# EAGLE design BlinkyBoard_wide (EAGLE 7.1.0)
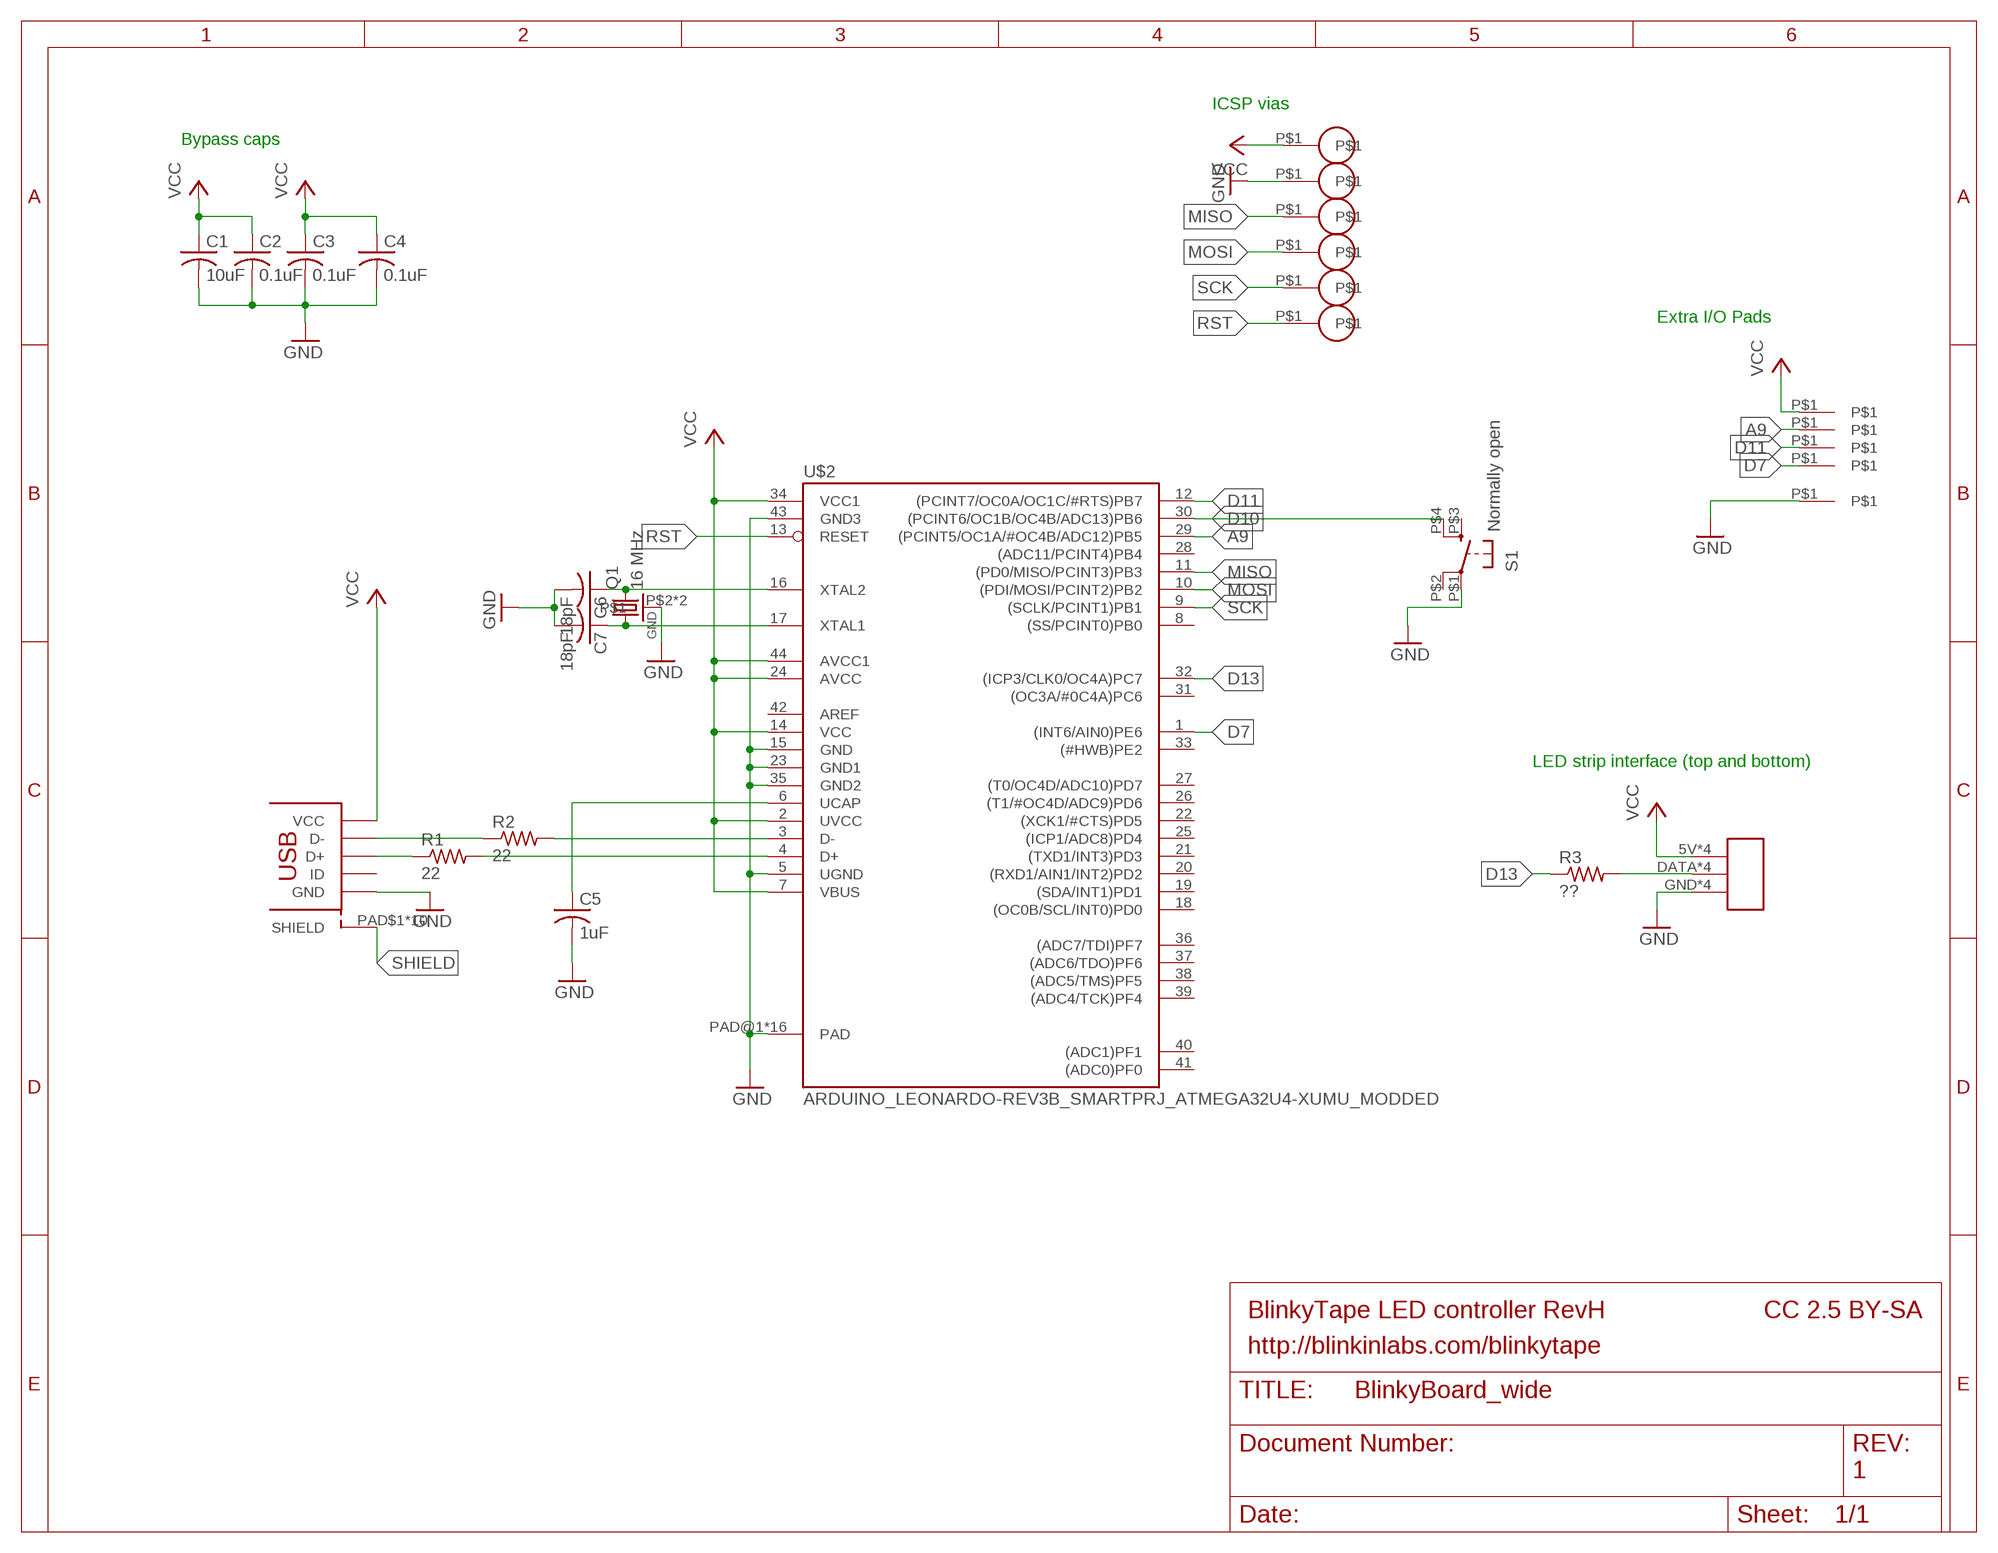
[diagram p0: schematic, sheet 1]

## Parts
C1  10uF  C-USC0603K  [C0603K]
C2  0.1uF  C_US  [CAP_0402_KEMET_MEDIAN]
C3  0.1uF  C_US  [CAP_0402_KEMET_MEDIAN]
C4  0.1uF  C_US  [CAP_0402_KEMET_MEDIAN]
C5  1uF  C_US  [CAP_0402_KEMET_MEDIAN]
C6  18pF  C_US  [CAP_0402_KEMET_MEDIAN]
C7  18pF  C_US  [CAP_0402_KEMET_MEDIAN]
Q1  16 MHz  CRYSTAL_4PAD2520  [CRSYTAL_2520]
R1  22  R_US  [RES_0402_KEMET_MEDIAN]
R2  22  R_US  [RES_0402_KEMET_MEDIAN]
R3  ??  R_US  [RES_0402_KEMET_MEDIAN]
S1  Normally open  GLOWBOARD_KMR211G  [GLOWBOARD_KMR211G_SWITCH]
U$1  TEST_VIA  [TEST_VIA_.5MM]
U$2  ARDUINO_LEONARDO-REV3B_SMARTPRJ_ATMEGA32U4-XUMU_MODDED  [QFN44ML_7X7_LONGLEADS_MOD]
U$3  TEST_VIA  [TEST_VIA_.5MM]
U$4  MICRO_USBSMT+THRUHULE  [MICRO_USB_FCI_THRUHOLE]
U$5  TEST_VIA  [TEST_VIA_.5MM]
U$6  TEST_VIA  [TEST_VIA_.5MM]
U$7  TEST_VIA  [TEST_VIA_.5MM]
U$8  TEST_VIA  [TEST_VIA_.5MM]
U$9  WS2812B_CONNECTORWIDE  [WS2812B_WIDE_CONNECTOR]
U$10  TEST_PAD_SMT  [TEST_PAD_SMT]
U$11  TEST_PAD_SMT  [TEST_PAD_SMT]
U$12  TEST_PAD_SMT  [TEST_PAD_SMT]
U$13  TEST_PAD_SMT  [TEST_PAD_SMT]
U$14  TEST_PAD_SMT  [TEST_PAD_SMT]

## Nets
A9: U$2.29((PCINT5/OC1A/#OC4B/ADC12)PB5) U$11.P$1
D7: U$2.1((INT6/AIN0)PE6) U$10.P$1
D10: S1.P$4(S1) U$2.30((PCINT6/OC1B/OC4B/ADC13)PB6)
D11: U$2.12((PCINT7/OC0A/OC1C/#RTS)PB7) U$14.P$1
D13: R3.P$1 U$2.32((ICP3/CLK0/OC4A)PC7)
D+: R1.P$2 U$2.4(D+)
D+_IN: R1.P$1 U$4.PIN$3(D+)
D-: R2.P$2 U$2.3(D-)
D-_IN: R2.P$1 U$4.PIN$2(D-)
GND: C1.2 C2.P$2 C3.P$2 C4.P$2 C5.P$2 C6.P$2 C7.P$2 Q1.P$2 Q1.P$4 S1.P$1(P) U$2.5(UGND) U$2.15(GND) U$2.23(GND1) U$2.35(GND2) U$2.43(GND3) U$2.PAD@1(PAD) U$2.PAD@2(PAD) U$2.PAD@3(PAD) U$2.PAD@4(PAD) U$2.PAD@5(PAD) U$2.PAD@6(PAD) U$2.PAD@7(PAD) U$2.PAD@8(PAD) U$2.PAD@9(PAD) U$2.PAD@10(PAD) U$2.PAD@11(PAD) U$2.PAD@12(PAD) U$2.PAD@13(PAD) U$2.PAD@14(PAD) U$2.PAD@15(PAD) U$2.PAD@16(PAD) U$4.PIN$5(GND) U$7.P$1 U$9.GND U$9.GND1(GND) U$9.GND_1(GND) U$9.GND_2(GND) U$13.P$1
LED_DATA: R3.P$2 U$9.DATA U$9.DATA1(DATA) U$9.DATA_1(DATA) U$9.DATA_2(DATA)
MISO: U$1.P$1 U$2.11((PD0/MISO/PCINT3)PB3)
MOSI: U$2.10((PDI/MOSI/PCINT2)PB2) U$3.P$1
N$2: C5.P$1 U$2.6(UCAP)
N$8: C6.P$1 Q1.P$3 U$2.16(XTAL2)
N$9: C7.P$1 Q1.P$1 U$2.17(XTAL1)
RST: U$2.13(RESET) U$6.P$1
SCK: U$2.9((SCLK/PCINT1)PB1) U$5.P$1
SHIELD: U$4.PAD$1(SHIELD) U$4.PAD$2(SHIELD) U$4.PAD$3(SHIELD) U$4.PAD$4(SHIELD) U$4.PAD$5(SHIELD) U$4.PAD$6(SHIELD) U$4.PAD$7(SHIELD) U$4.PAD$8(SHIELD) U$4.PAD$9(SHIELD) U$4.PAD$10(SHIELD)
VCC: C1.1 C2.P$1 C3.P$1 C4.P$1 U$2.2(UVCC) U$2.7(VBUS) U$2.14(VCC) U$2.24(AVCC) U$2.34(VCC1) U$2.44(AVCC1) U$4.PIN$1(VCC) U$8.P$1 U$9.5V U$9.5V1(5V) U$9.5V_1(5V) U$9.5V_2(5V) U$12.P$1
Unconnected: S1.P$2(P1) S1.P$3(S) U$2.8((SS/PCINT0)PB0) U$2.18((OC0B/SCL/INT0)PD0) U$2.19((SDA/INT1)PD1) U$2.20((RXD1/AIN1/INT2)PD2) U$2.21((TXD1/INT3)PD3) U$2.22((XCK1/#CTS)PD5) U$2.25((ICP1/ADC8)PD4) U$2.26((T1/#OC4D/ADC9)PD6) U$2.27((T0/OC4D/ADC10)PD7) U$2.28((ADC11/PCINT4)PB4) U$2.31((OC3A/#0C4A)PC6) U$2.33((#HWB)PE2) U$2.36((ADC7/TDI)PF7) U$2.37((ADC6/TDO)PF6) U$2.38((ADC5/TMS)PF5) U$2.39((ADC4/TCK)PF4) U$2.40((ADC1)PF1) U$2.41((ADC0)PF0) U$4.PIN$4(ID)

## Notes on the sheet
- ICSP vias
- Bypass caps
- Extra I/O Pads
- LED strip interface (top and bottom)
- BlinkyTape LED controller RevH | CC 2.5 BY-SA
- http://blinkinlabs.com/blinkytape
- 1

## Power pins joined to a net without a drawn wire
AREF: U$2.42(AREF)

## Library data of the parts
C1 = adafruit:C-US: CAPACITOR, American symbol
C2-C7 = blinkiverse:C_US
Q1 = blinkiverse:CRYSTAL_4PAD
R1-R3 = blinkiverse:R_US
S1 = blinkiverse:GLOWBOARD_KMR211G: KMR211G SWITCH
U$1 U$3 U$5-U$8 = blinkiverse:TEST_VIA
U$2 = blinkiverse:ARDUINO_LEONARDO-REV3B_SMARTPRJ_ATMEGA32U4-XU
U$4 = blinkiverse:MICRO_USB
U$9 = blinkinlabs:WS2812B_CONNECTOR
U$10-U$14 = blinkiverse:TEST_PAD_SMT

## Board
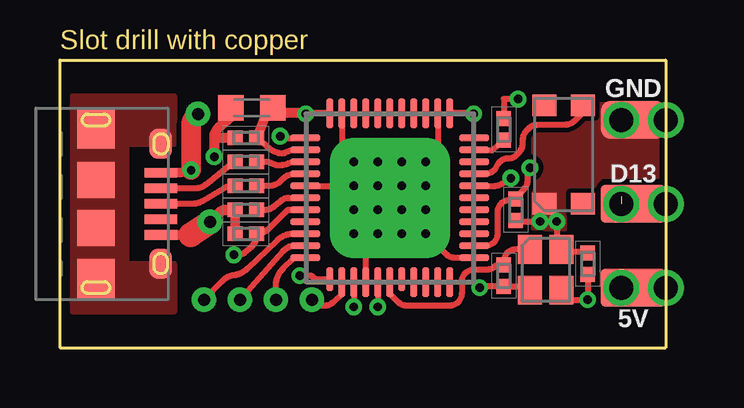
[diagram p1: board, top side]
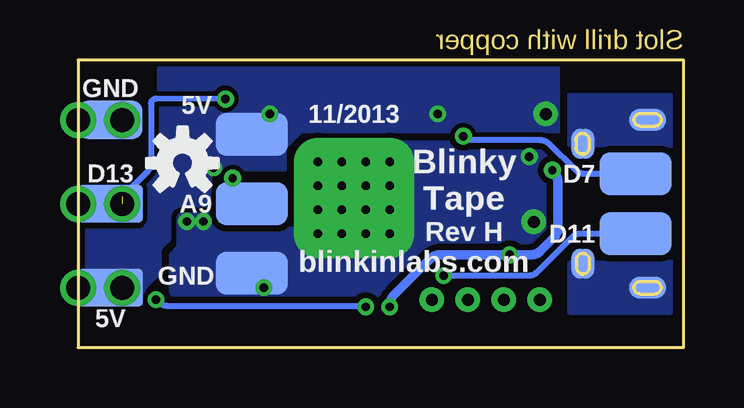
[diagram p2: board, bottom side, seen from below]

Size 25.25 x 12 mm. Coordinates in mm from the lower left corner, seen from the top.
Outline: 0,0 0,12 25.25,12 25.25,0 0,0
Copper layers (1*16): Top 0.0356mm / dielectric 1.5011mm / Bottom 0.0356mm
Design rules "BlinkyTape *": minimum track width 0.25mm, minimum drill 0.35mm, track to track 0.2mm, track to pad 0.2mm, pad to pad 0.2mm, via to via 0.2mm, smd to smd 0.2mm, copper to edge 8mil, drill to drill 0.25mm, minimum pad ring 7mil, minimum via ring 7mil, stop-mask expansion 2mil, vias tented up to drill 0.35mm, thermal gap 10mil

### Footprints (pad centres in the part's own frame; a part is rotated, then mirrored left to right if it is on the bottom)
C0603K = smd 1.05 x 1.08: 1 -0.875,0; 2 0.875,0
CAP_0402_KEMET_MEDIAN = smd 0.62 x 0.62: P$1 -0.45,0; P$2 0.45,0
CRSYTAL_2520 = smd 1.2 x 1: P$1 -0.85,-0.65; P$2 0.85,-0.65; P$3 0.85,0.65; P$4 -0.85,0.65
RES_0402_KEMET_MEDIAN = smd 0.62 x 0.62: P$1 -0.45,0; P$2 0.45,0
GLOWBOARD_KMR211G_SWITCH = smd 0.9 x 1: P$1 -2,0.8; P$2 2.1,0.8; P$3 -2,-0.8; P$4 2.1,-0.8
TEST_VIA_.5MM = drill 0.5 pad 1.016: P$1 0,0
QFN44ML_7X7_LONGLEADS_MOD = smd 1.25 x 0.275: 1 -3.525,2.5; 2 -3.525,2; 3 -3.525,1.5; 4 -3.525,1; 5 -3.525,0.5; 6 -3.525,0; 7 -3.525,-0.5; 8 -3.525,-1; 9 -3.525,-1.5; 10 -3.525,-2; 11 -3.525,-2.5; 23 3.525,-2.5; 24 3.525,-2; 25 3.525,-1.5; 26 3.525,-1; 27 3.525,-0.5; 28 3.525,0; 29 3.525,0.5; 30 3.525,1; 31 3.525,1.5; 32 3.525,2; 33 3.525,2.5 | smd 0.275 x 1: 12 -2.5,-3.4; 18 0.5,-3.4 | smd 0.275 x 1.25: 13 -2,-3.525; 14 -1.5,-3.525; 15 -1,-3.525; 16 -0.5,-3.525; 17 0,-3.525; 19 1,-3.525; 20 1.5,-3.525; 21 2,-3.525; 22 2.5,-3.525; 34 2.5,3.525; 35 2,3.525; 36 1.5,3.525; 37 1,3.525; 38 0.5,3.525; 39 0,3.525; 40 -0.5,3.525; 41 -1,3.525; 42 -1.5,3.525; 43 -2,3.525; 44 -2.5,3.525 | drill 0.35 pad 2: PAD@1 -1.5,1.5; PAD@4 1.5,1.5; PAD@13 -1.5,-1.5; PAD@16 1.5,-1.5 | drill 0.35 pad 2 square: PAD@2 -0.5,1.5; PAD@3 0.5,1.5; PAD@5 -1.5,0.5; PAD@8 1.5,0.5; PAD@9 -1.5,-0.5; PAD@12 1.5,-0.5; PAD@14 -0.5,-1.5; PAD@15 0.5,-1.5 | drill 0.35 pad 1 square: PAD@6 -0.5,0.5; PAD@7 0.5,0.5; PAD@10 -0.5,-0.5; PAD@11 0.5,-0.5
MICRO_USB_FCI_THRUHOLE = smd 1.645 x 1.55: PAD$1 -3.123,0; PAD$4 3.123,0 | smd 1.5 x 1.55: PAD$2 -1,0; PAD$3 1,0 | smd 1.25 x 0.95: PAD$5 -2.5,2.7; PAD$6 2.5,2.7 | smd 0.9 x 1.55 bottom: PAD$7 -3.5,0; PAD$8 3.5,0 | smd 1.25 x 0.95 bottom: PAD$9 -2.5,2.7; PAD$10 2.5,2.7 | smd 0.4 x 1.35: PIN$1 -1.3,2.7; PIN$2 -0.65,2.7; PIN$3 0,2.7; PIN$4 0.65,2.7; PIN$5 1.3,2.7
WS2812B_WIDE_CONNECTOR = smd 2.7 x 1.6 bottom: 5V 0,3.5; DATA1 0,0; GND1 0,-3.5 | smd 2.7 x 1.6: 5V1 0,3.5; DATA 0,0; GND 0,-3.5 | drill 1: 5V_1 1.35,3.5; 5V_2 -0.5,3.5 | drill 1 pad 1.5: DATA_1 1.35,0; DATA_2 -0.5,0; GND_1 1.35,-3.5; GND_2 -0.5,-3.5
TEST_PAD_SMT = smd 1.8 x 3: P$1 0,0

### Placement (x,y rotation side)
C1  8,10 180 top
C2  7.75,8.75 180 top
C3  7.75,4.75 180 top
C4  19,5.75 270 top
C5  7.75,5.75 180 top
C6  22,3.5 90 top
C7  18.5,3 270 top
Q1  20.25,3.25 270 top
R1  7.75,6.75 0 top
R2  7.75,7.75 0 top
R3  18.5,9.1 90 top
S1  21,8 90 top
U$1  9,2 0 top
U$2  13.75,6.25 0 top
U$3  7.5,2 0 top
U$4  1.5,6 270 top
U$5  6,2 0 top
U$6  10.5,2 0 top
U$7  6.25,5.25 0 top
U$8  5.75,9.75 0 top
U$9  23.9,6 180 bottom
U$10  2,7.25 90 bottom
U$11  18,6 90 bottom
U$12  18,8.9 270 bottom
U$13  18,3.1 270 bottom
U$14  2,4.75 270 bottom
U$15  [OSHW-LOGO-S]  20.89,7.7 0 bottom

### Tracks (layer width: path | path; a pad name or v marks a point on that pad's centre or on a via)
A9  (via drill 0.35)
  Top 0.254: U$2.29 18.15,6.75 arc33 18.43,6.83 v18.8,7.07
  Bottom 0.254: U$11.P$1 18.55,6.5 v18.8,7.07
D7  (via drill 0.35)
  Top 0.254: v9.18,8.82 9.14,8.75 U$2.1
  Bottom 0.254: U$10.P$1 4.13,7.25 arc47 4.5,7.41 5.6,8.49 arc-47 5.97,8.65 9.12,8.65 v9.18,8.82
D10
  Top 0.254: U$2.30 17.7,7.25 arc45 18.13,7.43 18.26,7.66 arc-45 18.65,7.9 arc45 18.98,7.98 19.12,8.12 arc45 19.3,8.55 19.3,8.65 arc-45 19.48,9.08 19.52,9.12 arc-45 19.95,9.3 21.05,9.3 arc45 21.48,9.48 21.8,9.8 S1.P$4
D11  (via drill 0.35)
  Top 0.254: U$2.12 10.73,2.85 arc-45 10.59,2.91 10.56,2.94 arc45 10.42,3 v10,3
  Bottom 0.254: U$14.P$1 4.29,4.75 arc-45 4.65,4.6 6.1,3.15 arc45 6.46,3 v10,3
D13
  Top 0.254: U$2.32 18.05,8.25 R3.P$1
D+
  Top 0.254: U$2.4 9.81,7.25 arc45 9.21,6.96 arc-45 8.81,6.75 R1.P$2
D+_IN
  Top 0.254: R1.P$1 7.19,6.75 arc31 6.83,6.65 5.92,6.1 arc-31 5.56,6 U$4.PIN$3
D-
  Top 0.254: U$2.3 9.7,7.75 9.42,7.64 arc-23 9.02,7.6 8.78,7.71 arc24 8.57,7.75 R2.P$2
D-_IN
  Top 0.254: U$4.PIN$2 5.65,6.65 arc39 6.09,6.81 7.21,7.72 arc-39 R2.P$1
GND  (via drill 0.35)  (1 unrouted)
  Top 0.254: U$2.5 U$2.PAD@5 | U$2.15 12.75,4.04 arc-45 12.9,4.4 U$2.PAD@14 | U$2.PAD@16 16.1,3.9 arc45 16.46,3.75 U$2.23 17.25,3.73 | U$2.43 11.75,8.46 arc45 11.9,8.1 U$2.PAD@1 | U$2.35 15.75,8.46 arc-45 15.6,8.1 U$2.PAD@4 | 19,5.12 18.95,5.3 C4.P$2 19.04,5.26 v20.02,5.26 | v17.5,2.5 17.55,2.55 C7.P$2 19.45,2.55 Q1.P$2 | C6.P$2 22,4 21,4 Q1.P$4 | Q1.P$4 20.82,4.18 | v20.71,5.26 20.71,4.29 Q1.P$4
  Top 0.4: C2.P$2 7,8.75 | 7.25,5.75 C5.P$2 C3.P$2 | U$4.PIN$5 5.45,4.7
  Top 0.406: C1.2 7.12,9.62 6.6,9.15 arc48 6.43,8.78 6.43,8.75 | 6.43,8.75 v6.43,7.96 | 7,8.75 6.43,8.75 | U$7.P$1 6.6,5.6 arc-45 6.96,5.75 C5.P$2
  Top 1.016: 5.45,4.7 U$7.P$1
  pour Bottom (isolate 0.254): 5.75,8.6 15.6,8.6 16,8.2 16,5 19.6,5 19.6,5.6 20.85,5.6 arc-90 21.1,5.35 21.1,4.3 arc45 21.17,4.13 21.33,3.97 arc-45 21.4,3.8 21.4,0 5.75,0
  pour Top: 25.1,7.1 25.1,10.2 21.1,10.2 21.1,9.4 19.7,9.4 19.7,4.9 21.1,4.9 21.1,6.6 22.2,6.6 22.6,7.1
LED_DATA  (via drill 0.35)  (2 unrouted)
  Top 0.254: v19.1,10.37 18.5,10.37 R3.P$2
  Bottom 0.254: v19.1,10.37 22,10.38 arc-90 22.2,10.18 22.2,7.71 arc45 22.35,7.35 23.4,6.3
  Bottom 0.406: U$9.DATA_1 U$9.DATA U$9.DATA_2
MISO
  Top 0.254: U$2.11 9.75,3.75 9.28,3.27 arc44 9,2.57 U$1.P$1
MOSI
  Top 0.254: U$2.10 9.82,4.25 arc48 9.3,4.02 U$3.P$1
N$2
  Top 0.254: C5.P$1 8.57,5.75 arc39 8.89,5.86 9.24,6.14 arc-39 9.55,6.25 U$2.6
N$8  (via drill 0.35)
  Top 0.254: U$2.16 v13.25,1.7 | Q1.P$3 21.1,2 v22,2 C6.P$1
  Bottom 0.254: v13.25,1.7 arc-90 13.3,1.75 21.54,1.75 arc45 21.9,1.9 v22,2
N$9
  Top 0.254: U$2.17 13.75,2.25 14.1,1.9 arc45 14.46,1.75 16.25,1.75 arc90 16.75,2.25 16.75,2.75 arc-90 17.25,3.25 17.79,3.25 arc45 18.15,3.4 arc-45 18.28,3.45 C7.P$1 18.5,3.6 arc-90 19,4.1 Q1.P$1
RST
  Top 0.254: U$2.13 11.75,2.25 11.4,1.9 arc-45 11.04,1.75 10.96,1.75 arc-45 10.6,1.9 U$6.P$1
SCK
  Top 0.254: U$2.9 9.75,4.75 arc43 9.06,4.48 7.81,3.3 arc-43 7.26,3.02 arc45 6.75,2.75 U$5.P$1
SHIELD  (2 unrouted)
  pour Top: 0.55,10.5 4.75,10.5 4.75,8.5 2.75,8.5 2.75,3.5 4.75,3.5 4.75,1.5 0.55,1.5
  pour Bottom (isolate 0.254): 0.55,10.5 4.75,10.5 4.75,8.5 2.75,8.5 2.75,3.5 4.75,3.5 4.75,1.5 0.55,1.5
VCC  (via drill 0.35)  (1 unrouted)
  Top 0.254: v17.25,9.75 17,9.78 U$2.34 | U$2.14 v12.25,1.7 | U$2.44 10.22,9.78 v10.25,9.75 | U$2.24 17.75,4.25 arc90 18.25,4.75 18.25,5.66 arc-82 18.68,6.15 C4.P$1 19.38,6.65 arc40 19.5,6.97 19.5,7.5 v19.6,7.5 | U$2.7 9.58,5.75 arc45 9.44,5.69 8.71,4.96 arc-45 C3.P$1 arc-46 7.99,4.2 7.68,3.94 arc-44 v7.25,3.87 | U$2.2 9.7,8.25 9.35,8.11 arc-13 9.22,8.1 arc-42 8.6,8.42 8.48,8.53 8.25,8.75 C2.P$1
  Top 0.4: U$4.PIN$1 5.05,7.3 v5.47,7.4
  Top 0.406: C2.P$1 8.63,9.84 arc-68 C1.1 8.88,9.78 10.22,9.78
  Top 0.813: v5.47,7.4 5.47,9.28 arc-48 5.64,9.65 U$8.P$1
  Bottom 0.4: v12.25,1.7 12.25,1.79 arc45 12.11,2.15 10.65,3.62 arc45 10.19,3.87 v7.25,3.87 6.34,3.87 arc-45 5.98,4.02 5.4,4.6 arc-45 5.25,4.96 5.25,6.99 arc-56 v5.47,7.4
  pour Bottom (no thermals): 5.2,12 21.9,12 21.9,7.39 arc40 21.96,7.23 22.34,6.77 arc-40 22.4,6.61 22.4,5.2 arc45 22.47,5.03 22.53,4.97 arc45 22.7,4.9 25.2,4.9 25.2,1.8 22.5,1.8 22.5,2.3 arc45 22.43,2.47 21.87,3.03 arc-45 21.8,3.2 21.8,4 arc45 21.73,4.17 21.47,4.43 arc-45 21.4,4.6 21.4,5.45 arc90 20.95,5.9 19.7,5.9 19.7,7.4 16.6,7.4 16.6,8.3 15.9,9 5.2,9

### Text on the board
tNames: GND | D13 | 5V
bNames: 11/2013 | 5V | GND | D7 | Blinky / Tape | D13 | A9 | D11 | Rev H | blinkinlabs.com | GND | 5V
Milling: Slot drill with copper